# EAGLE design jst_splitter (EAGLE 9.6.2)
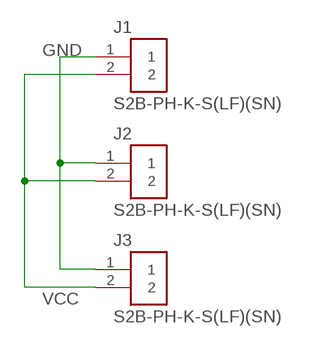
[diagram p0: schematic, sheet 1]

## Parts
J1  S2B-PH-K-S(LF)(SN)  [S2B-PH-K-S(LF)(SN)]
J2  S2B-PH-K-S(LF)(SN)  [S2B-PH-K-S(LF)(SN)]
J3  S2B-PH-K-S(LF)(SN)  [S2B-PH-K-S(LF)(SN)]

## Nets
GND: J1.1 J2.1 J3.1
VCC: J1.2 J2.2 J3.2

## Library data of the parts
J1-J3 = Connectors:S2B-PH-K-S(LF)(SN): CONN HEADER R/A 2POS 2MM Manufacturer's datasheet <http://www.jst-mfg.com/product/pdf/eng/ePH.pdf>; CREATED_BY: PCBLayout.com; DIGI_KEY_PART_NUMBER: 455-1719-ND; MANUFACTURER: JST Sales America Inc.; MPN: S2B-PH-K-S(LF)(SN)

## Board
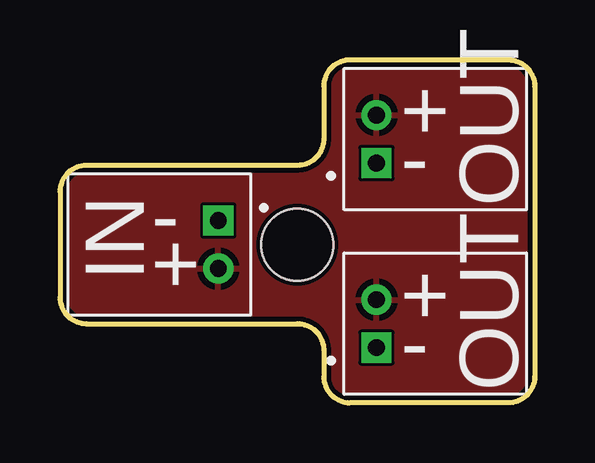
[diagram p1: board, top side]
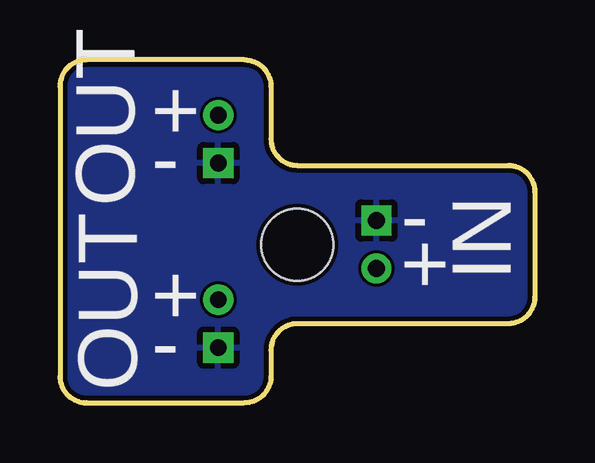
[diagram p2: board, bottom side, seen from below]

Size 19.8 x 14.3 mm. Coordinates in mm from the lower left corner, seen from the top.
Outline: 12.1,14.3 18.7,14.3 arc-90 19.8,13.2 19.8,1.1 arc-90 18.7,0 12.1,0 arc-90 11,1.1 11,2.2 arc90 9.9,3.3 1.1,3.3 arc-90 0,4.4 0,8.8 arc-90 1.1,9.9 9.9,9.9 arc90 11,11 11,13.2 arc-90 12.1,14.3
Copper layers (1*16): Top 0.035mm / dielectric 1.6mm / Bottom 0.035mm
Design rules "jlcpcb-2layers": minimum track width 5mil, minimum drill 0.3mm, track to track 5mil, track to pad 5mil, pad to pad 5mil, via to via 5mil, smd to smd 5mil, copper to edge 0.2mm, drill to drill 6mil, minimum pad ring 10mil, minimum via ring 3mil, stop-mask expansion 4mil, vias tented up to drill 0mil, thermal gap 10mil
Holes 3 mm at 9.9,6.6

### Footprints (pad centres in the part's own frame; a part is rotated, then mirrored left to right if it is on the bottom)
S2B-PH-K-S(LF)(SN) = drill 0.7 square: 1 -1,0 | drill 0.7: 2 1,0

### Placement (x,y rotation side)
J1  6.6,6.6 270 top
J2  13.2,11 90 top
J3  13.2,3.3 90 top

### Tracks (layer width: path | path; a pad name or v marks a point on that pad's centre or on a via)
GND
  pour Bottom: -3.3,17.6 23.1,17.6 23.1,-3.3 -3.3,-3.3
VCC
  pour Top: -1.1,15.4 20.9,15.4 20.9,-1.1 -1.1,-1.1

### Text on the board
tPlace: + | - | OUT | - | IN | + | + | - | OUT
bPlace: + | - | OUT | - | IN | + | + | - | OUT